# Altium schematic sheet MakerFaireGent_2025_00.SchDoc: Maker Faire Gent Solder Kit
size A3; Date: 28/03/2025; DrawnBy: Wim Van Gool; DocumentNumber: 1; Revision: 00; SheetNumber: 1; SheetTotal: 1
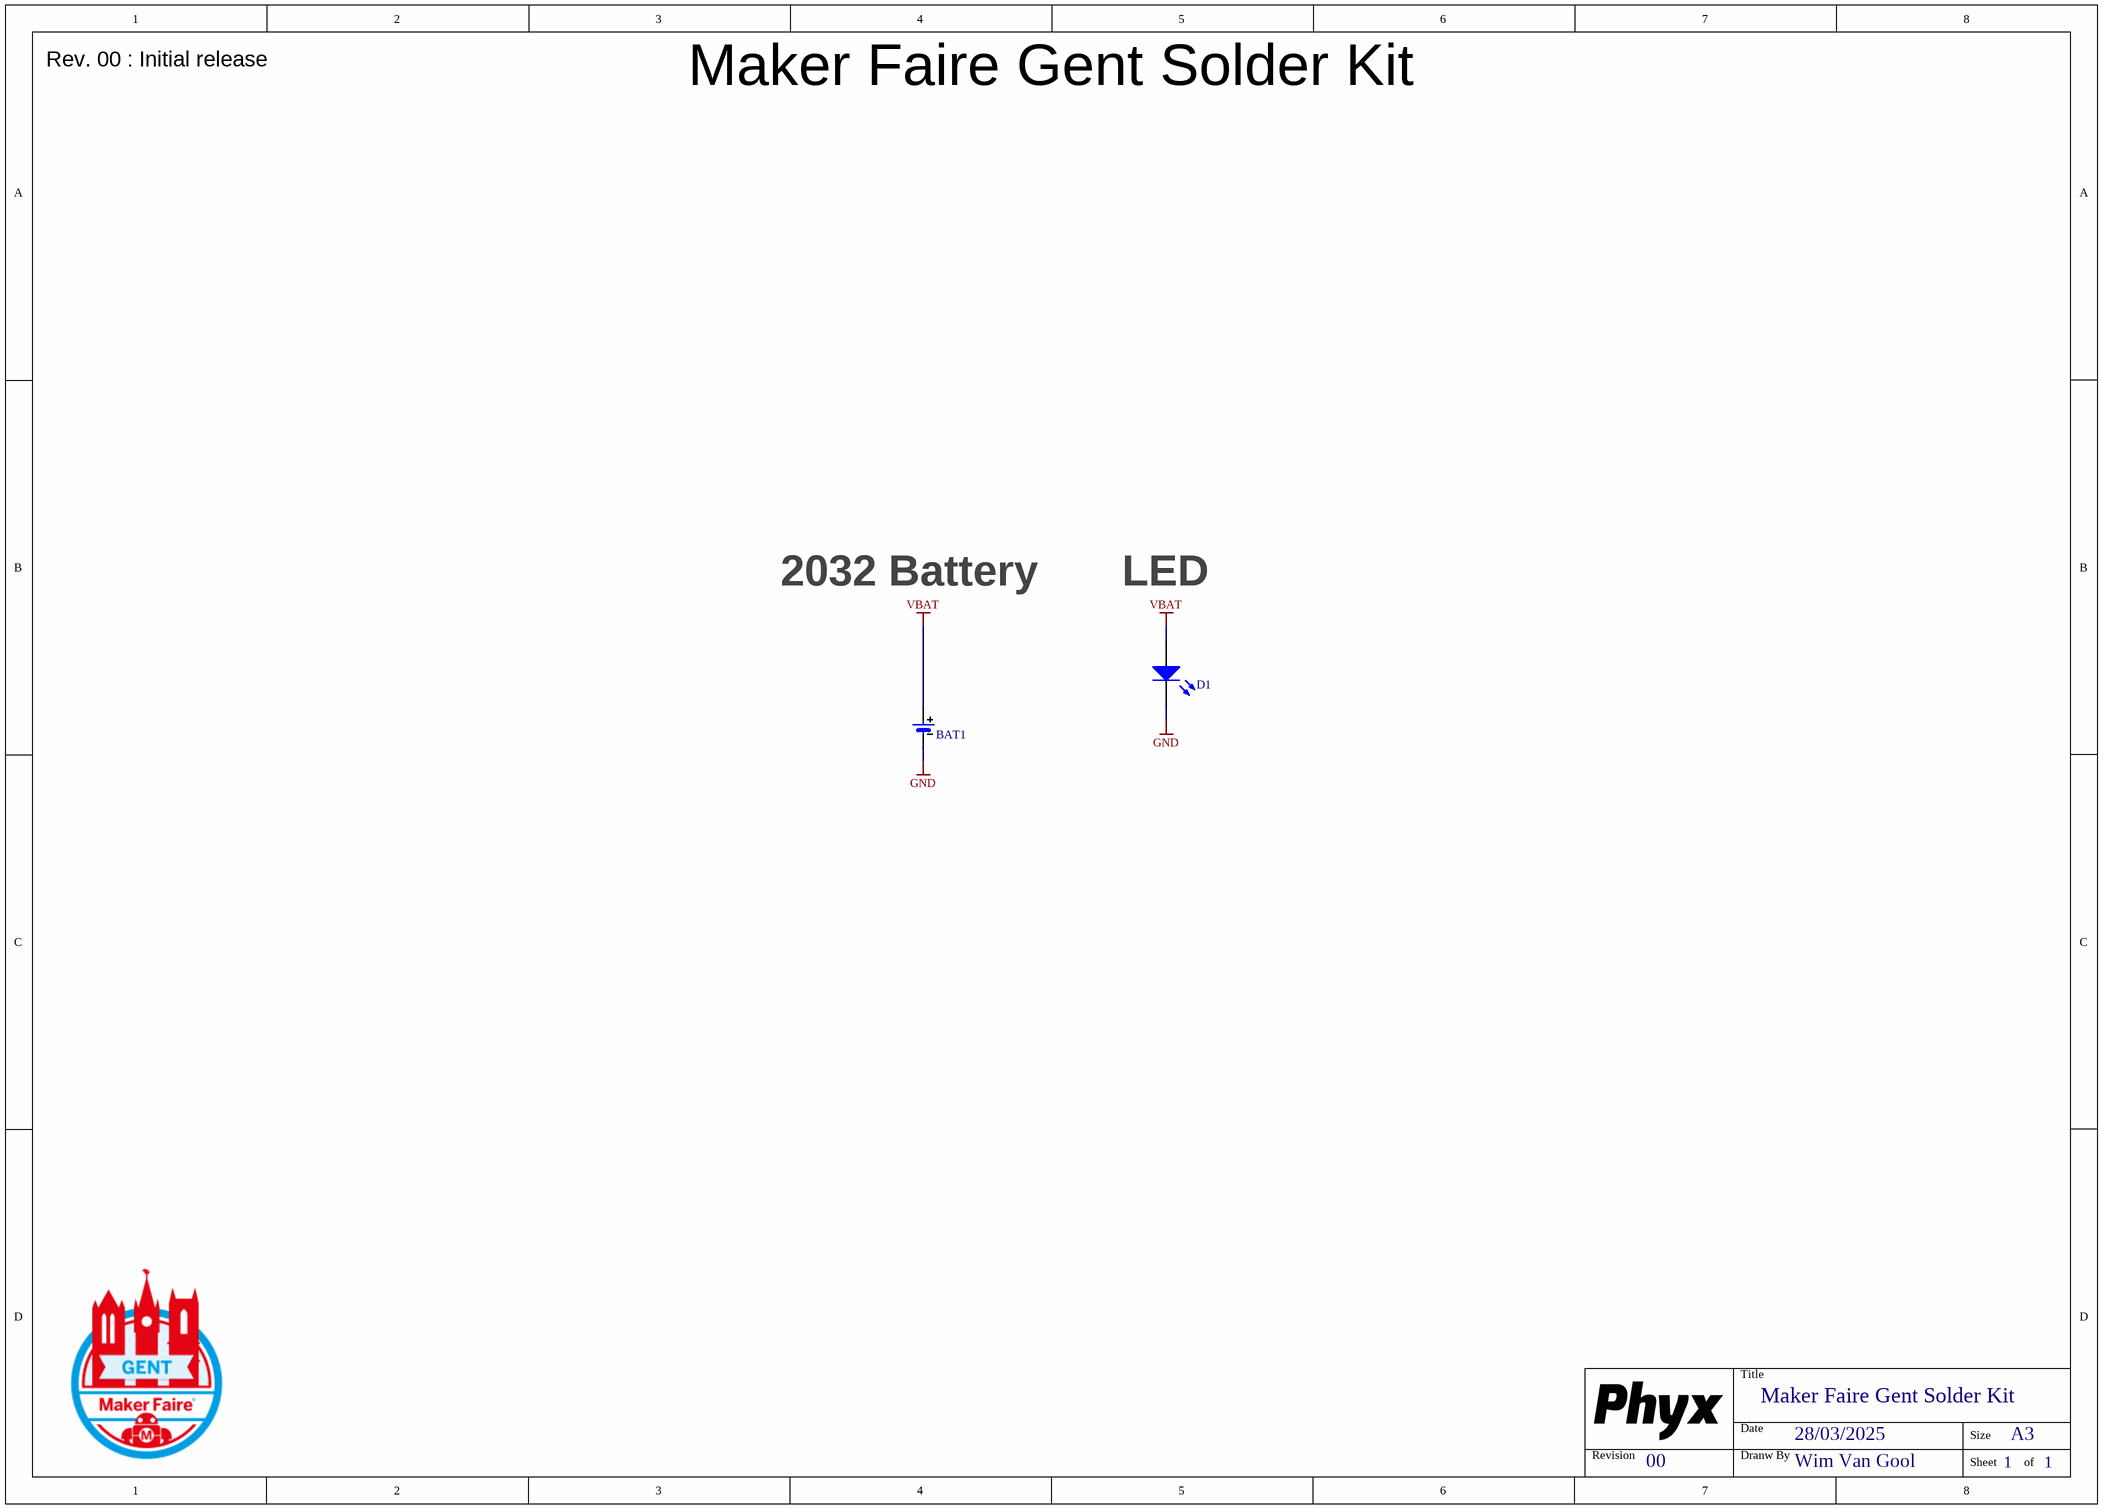
[diagram p0: MakerFaireGent_2025_00.SchDoc]

## Parts
BAT1  CR2032 Battery Holder  [BAT_CR2032_China]  (value not drawn)
D1  Default 5mm Blue LED  [LED_5MM_BL]  (value not drawn)

## Nets
GND: BAT1.2 D1.2(K)
VBAT: BAT1.1 D1.1(A)

## Notes on the sheet
- Rev. 00 : Initial release
- 2032 Battery
- LED
- Title
- Revision
- Date
- Dranw By
- Size
- A3
- Sheet
- of

## Library data of the parts
BAT1 = BAT 20mm Coin Cell Holder Generic: =Description; Value: CR2032; Supplier 1: LCSC; Supplier Part Number 1: C5239862; Supplier 2: LCSC; Supplier Part Number 2: C70376
D1 = LED Blue 5mm: =Description; Description: LED Blue 5mm